# EAGLE design Sensor Board v2 (EAGLE 8.2.1)
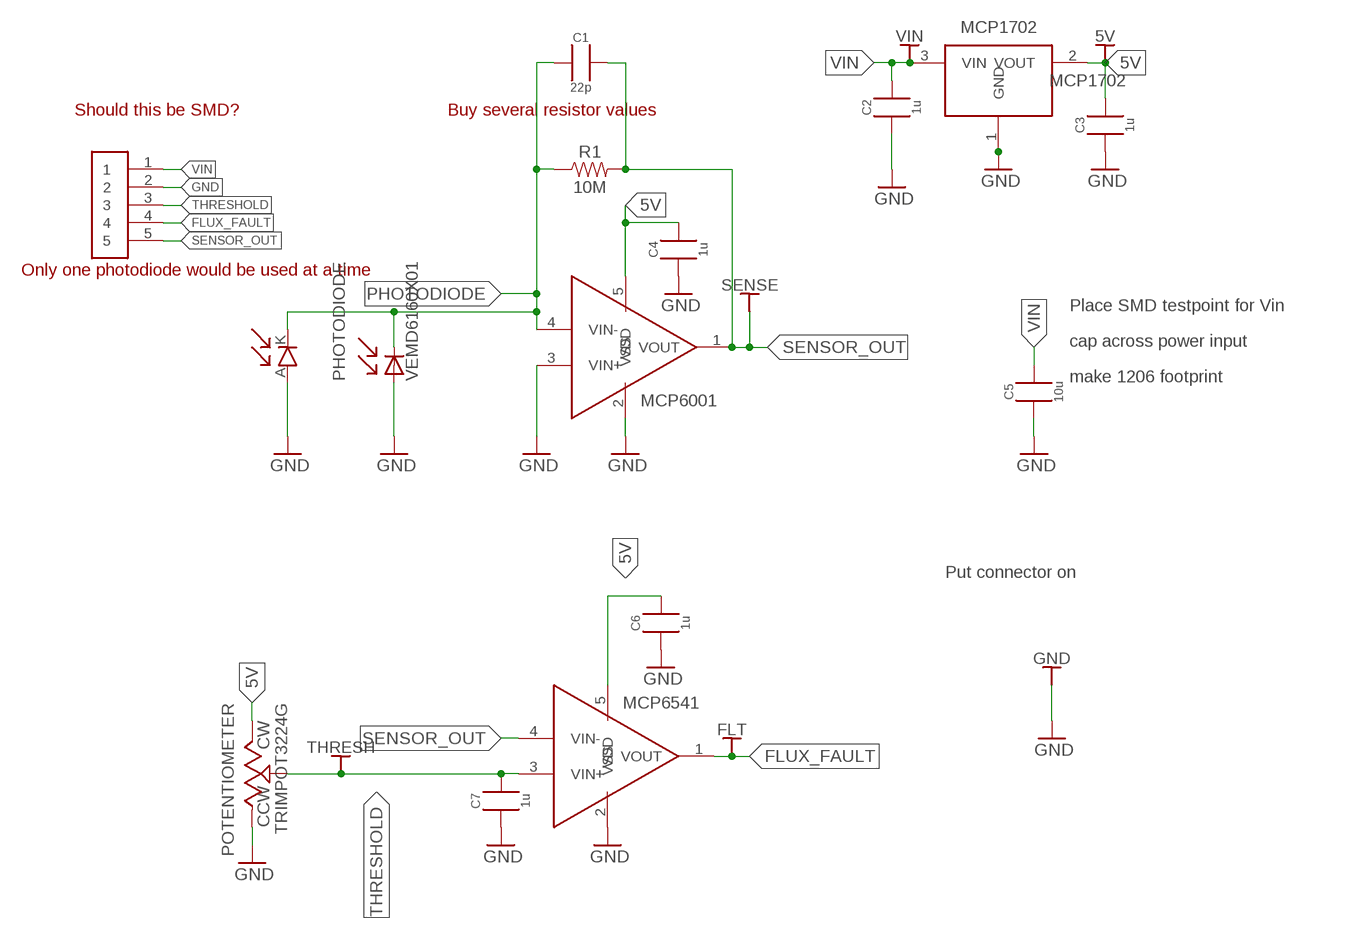
[diagram p0: schematic, sheet 1]

## Parts
5V  TEST_POINT5015  [5015]
C1  22p  CAP0805C  [0805_C]
C2  1u  CAP0805C  [0805_C]
C3  1u  CAP805B  [0805_B]
C4  1u  CAP805B  [0805_B]
C5  10u  CAP1206A  [1206_A]
C6  1u  CAP805B  [0805_B]
C7  1u  CAP805B  [0805_B]
FLT  TEST_POINT5015  [5015]
GND  TEST_POINT5015  [5015]
MCP1702  MCP1702  [SOT23A(CB)]
MCP6001  MCP6001MCP6001  [SOT23(OT)]
MCP6541  MCP6541  [SOT23(OT)]
PHOTODIODE  VEMD6160X01  [VEMD6160X01]
R1  10M  RESISTOR1206  [1206]
SENSE  TEST_POINT5015  [5015]
THRESH  TEST_POINT5015  [5015]
TRIMPOT3224G  POTENTIOMETER  [3224G]
U$1  M05OSTVN05  [OSTVN05]
U$2  PHOTODIODE  [LTR-516AD]
VIN  TEST_POINT5015  [5015]

## Nets
5V [power]: 5V.1 C3.2 C4.2 C6.2 MCP1702.2(VOUT) MCP6001.5(VDD) MCP6541.5(VDD) TRIMPOT3224G.3(CW)
FLUX_FAULT: FLT.1 MCP6541.1(VOUT) U$1.4
GND [power]: C2.1 C3.1 C4.1 C5.1 C6.1 C7.1 GND.1 MCP1702.1(GND) MCP6001.2(VSS) MCP6001.3(VIN+) MCP6541.2(VSS) PHOTODIODE.A1(A) TRIMPOT3224G.1(CCW) U$1.2 U$2.A
PHOTODIODE: C1.1 MCP6001.4(VIN-) PHOTODIODE.K(C) R1.1 U$2.K(C)
SENSOR_OUT: C1.2 MCP6001.1(VOUT) MCP6541.4(VIN-) R1.2 SENSE.1 U$1.5
THRESHOLD: C7.2 MCP6541.3(VIN+) THRESH.1 TRIMPOT3224G.2(WIPER) U$1.3
VIN [power]: C2.2 C5.2 MCP1702.3(VIN) U$1.1 VIN.1

## Notes on the sheet
- Should this be SMD? | Buy several resistor values
- Only one photodiode would be used at a time
- Place SMD testpoint for Vin
- cap across power input
- make 1206 footprint
- Put connector on

## Library data of the parts
5V FLT GND SENSE THRESH VIN = Keystone:TEST_POINT
C1-C7 = KEMET:CAP
MCP1702 = MICROCHIP:MCP1702: Voltage Regulator http://ww1.microchip.com/downloads/en/DeviceDoc/22008E.pdf
MCP6001 = MICROCHIP:MCP6001: MCP6001 OP AMP Single http://ww1.microchip.com/downloads/en/DeviceDoc/21733j.pdf; DIGIKEY: MCP3008T-I/SLCT-ND
MCP6541 = MICROCHIP:MCP6541: MCP6541 single push-pull comparator http://ww1.microchip.com/downloads/en/DeviceDoc/21696H.pdf
PHOTODIODE = VISHAY:VEMD6160X01: IR Photodiode http://www.vishay.com/docs/84306/vemd6160x01.pdf
R1 = Stackpole:RESISTOR
TRIMPOT3224G = Bourns:POTENTIOMETER
U$1 = OST:M05
U$2 = LITEON:PHOTODIODE

## Net classes
1 power: width 0.3 mm

## Board
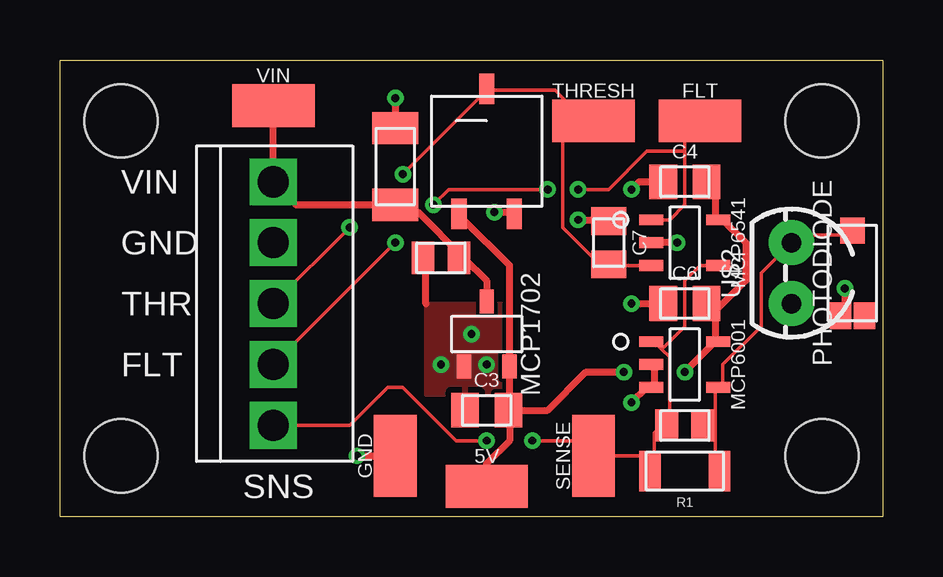
[diagram p1: board, top side]
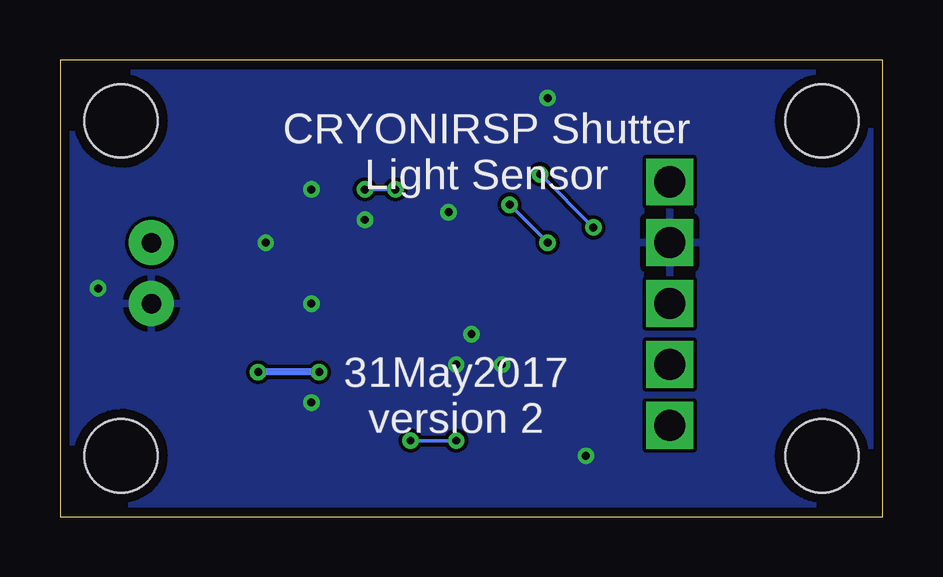
[diagram p2: board, bottom side, seen from below]

Size 34.29 x 19.05 mm. Coordinates in mm from the lower left corner, seen from the top.
Outline: 0,0 0,19.05 34.29,19.05 34.29,0 0,0
Copper layers (1*16): Top 0.0356mm / dielectric 1.5011mm / Bottom 0.0356mm
Design rules "oshpark-2layer": minimum track width 6mil, minimum drill 13mil, track to track 6mil, track to pad 6mil, pad to pad 6mil, via to via 6mil, smd to smd 6mil, copper to edge 15mil, drill to drill 6mil, minimum pad ring 7mil, minimum via ring 7mil, stop-mask expansion 2.5mil, vias tented up to drill 0mil, thermal gap 10mil

### Footprints (pad centres in the part's own frame; a part is rotated, then mirrored left to right if it is on the bottom)
5015 = smd 3.429 x 1.778: 1 0,0
0805_C = smd 0.95 x 1.35: 1 -0.75,0; 2 0.75,0
0805_B = smd 1.15 x 1.45: 1 -0.9,0; 2 0.9,0
1206_A = smd 1.35 x 1.9: 1 -1.6,0; 2 1.6,0
SOT23A(CB) = smd 0.6 x 1: 1 -0.95,-1.35; 2 0.95,-1.35; 3 0,1.35
SOT23(OT) = smd 1 x 0.45: 1 -1.4,0.95; 2 -1.4,0; 3 -1.4,-0.95; 4 1.4,-0.95; 5 1.4,0.95
VEMD6160X01 = smd 1.09 x 0.88: A1 -1.774,0.5; X -1.775,-0.5 | smd 1.09 x 1.02: K 1.775,0
1206 = smd 0.9 x 1.7: 1 -1.45,0; 2 1.45,0
3224G = smd 1.27 x 0.635: 1 2.6,1.15; 2 -2.6,0; 3 2.6,-1.15
OSTVN05 = drill 1.3 square: 1 -5.08,0; 2 -2.54,0; 3 0,0; 4 2.54,0; 5 5.08,0
LTR-516AD = drill 0.813 pad 1.88: A -1.27,0; K 1.27,0
STAND-OFF-TIGHT = hole 3.048: 0,0

### Placement (x,y rotation side)
5V  17.78,1.27 0 top
C1  26.04,3.81 180 top
C2  15.87,10.79 0 top
C3  17.78,4.44 0 top
C4  26.04,13.97 0 top
C5  13.97,14.6 270 top
C6  26.04,8.89 0 top
C7  22.86,11.43 270 top
FLT  26.67,16.51 0 top
GND  13.97,2.54 90 top
MCP1702  17.78,7.62 0 top
MCP6001  26.04,6.35 0 top
MCP6541  26.04,11.43 0 top
PHOTODIODE  33.02,10.16 90 top
R1  26.04,1.9 180 top
SENSE  22.22,2.54 90 top
THRESH  22.22,16.51 0 top
TRIMPOT3224G  17.78,15.24 270 top
U$1  8.89,8.89 270 top
U$2  30.48,10.16 90 top
U$3  [STAND-OFF-TIGHT]  31.75,16.51 0 top
U$4  [STAND-OFF-TIGHT]  31.75,2.54 0 top
U$5  [STAND-OFF-TIGHT]  2.54,2.54 0 top
U$6  [STAND-OFF-TIGHT]  2.54,16.51 0 top
VIN  8.89,17.14 0 top

### Tracks (layer width: path | path; a pad name or v marks a point on that pad's centre or on a via)
5V  (via drill 0.33)
  Top 0.3: 27.3,8.57 27.3,7.3 | 27.3,8.57 26.99,8.89 C6.2 27.3,8.57 | C4.2 26.99,13.97 27.3,13.65 27.3,12.38 MCP6541.5 27.62,12.38 28.57,11.43 28.57,9.84 27.3,8.57 | 18.73,4.44 18.73,6.03 MCP1702.2 18.73,6.35 18.73,10.48 16.83,12.38 TRIMPOT3224G.3 | 5V.1 17.78,2.22 18.73,3.17 18.73,4.44 | v26.04,6.03 27.3,7.3 | v23.5,6.03 21.91,6.03 20.32,4.44 18.73,4.44 | 27.3,7.3 MCP6001.5 | 18.73,4.44 C3.2
  Bottom 0.3: v23.5,6.03 v26.04,6.03
FLUX_FAULT  (via drill 0.33)
  Top 0.152: 26.04,15.24 26.04,15.87 FLT.1 | 26.04,15.24 26.04,13.02 25.4,12.38 24.76,12.38 MCP6541.1 | v13.97,11.43 U$1.4 | v15.56,13.02 16.19,13.65 v20.32,13.65 | v21.59,13.65 22.86,13.65 24.45,15.24 26.04,15.24
  Bottom 0.152: v15.56,13.02 v13.97,11.43 | v21.59,13.65 v20.32,13.65
GND  (via drill 0.33)
  Top 0.3: MCP6001.2 24.76,6.35 24.76,5.4 MCP6001.3 24.45,5.4 v23.81,4.76 | v25.72,11.43 MCP6541.2 | v32.7,9.53 32.7,8.57 PHOTODIODE.A1 | v18.1,12.7 18.73,12.7 TRIMPOT3224G.1 | 15.24,8.89 15.24,10.79 C2.1 | v21.59,12.38 22.86,12.38 C7.1 | v23.81,8.89 C6.1 | C4.1 24.13,13.97 v23.81,13.65 | v13.97,17.46 C5.1 | v12.38,2.54 GND.1
  other vias: 17.14,7.62 15.87,6.35 17.78,6.35
  pour Bottom: -3.81,21.59 38.1,21.59 38.1,-3.81 -3.81,-3.81
  pour Top: 15.24,8.89 20.32,8.89 20.32,5.08 15.24,5.08
PHOTODIODE
  Top 0.152: 27.3,4.13 27.3,5.4 MCP6001.4 27.62,5.4 27.62,6.35 29.21,7.94 29.21,10.16 U$2.K 30.8,11.75 33.02,11.75 PHOTODIODE.K | 27.3,4.13 26.99,3.81 C1.1 | 27.3,4.13 27.3,1.9 R1.1
SENSOR_OUT  (via drill 0.33)
  Top 0.152: 25.08,6.98 25.4,6.67 25.4,3.81 C1.2 25.08,3.81 24.76,3.49 24.76,2.54 | 25.08,6.98 24.76,7.3 MCP6001.1 | 25.08,6.98 26.04,7.94 26.04,9.84 26.67,10.48 27.3,10.48 MCP6541.4 | 24.76,2.54 24.76,1.9 R1.2 24.76,2.54 | 24.76,2.54 SENSE.1 21.59,3.17 v19.68,3.17 | U$1.5 12.06,3.81 13.65,5.4 14.29,5.4 16.51,3.17 v17.78,3.17
  Bottom 0.152: v19.68,3.17 v17.78,3.17
THRESHOLD  (via drill 0.33)
  Top 0.152: MCP6541.3 24.45,10.48 22.86,10.48 C7.2 22.86,10.79 22.22,10.79 20.96,12.06 20.96,17.46 | 17.78,17.78 20.64,17.78 20.96,17.46 | 20.96,17.46 21.91,16.51 THRESH.1 | v12.06,12.06 U$1.3 | 17.78,17.78 v14.29,14.29 | 17.78,17.78 TRIMPOT3224G.2
  Bottom 0.152: v14.29,14.29 v12.06,12.06
VIN
  Top 0.3: MCP1702.3 17.78,9.84 16.83,10.79 | 16.83,10.79 14.92,12.7 13.97,12.7 C5.2 13.97,13.02 9.84,13.02 U$1.1 VIN.1 | 16.83,10.79 C2.2

### Text on the board
bPlace: CRYONIRSP Shutter / Light Sensor | 31May2017 / version 2
tNames: VIN | GND | THR | FLT | SNS